# EAGLE schematic final-schematic (EAGLE 8.4.1)
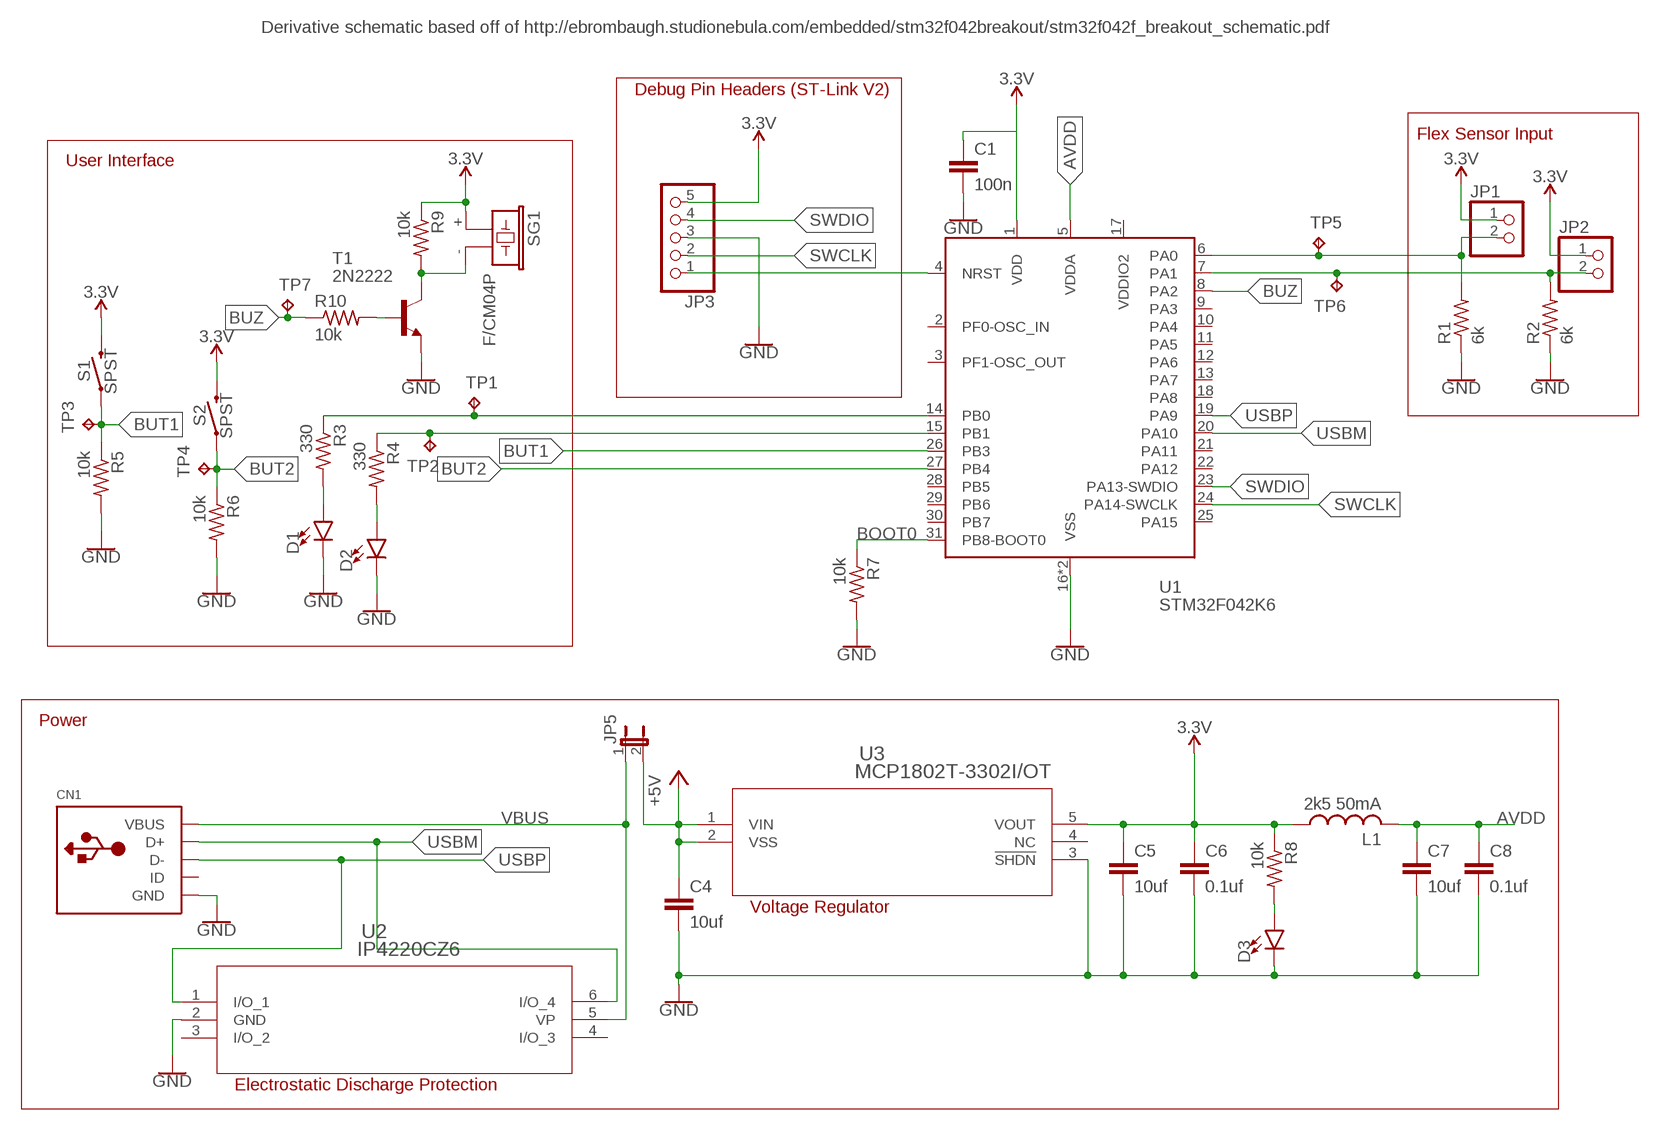
[diagram p0: schematic, sheet 1]

## Parts
C1  100n  C-EUC0805  [C0805]
C4  10uf  C-EUC0805  [C0805]
C5  10uf  C-EUC0805  [C0805]
C6  0.1uf  C-EUC0805  [C0805]
C7  10uf  C-EUC0805  [C0805]
C8  0.1uf  C-EUC0805  [C0805]
CN1  USBMOLEX  [USB-MINIB-THM-MOLEX]
D1  LED10MM  [LED_10MM]
D2  LED10MM  [LED_10MM]
D3  LED10MM  [LED_10MM]
JP1  PINHD-1X2  [1X02]
JP2  PINHD-1X2  [1X02]
JP3  PINHD-1X5  [1X05]
JP5  JP1E  [JP1]
L1  2k5 50mA  L-USL3216C  [L3216C]
R1  6k  R-US_R0805  [R0805]
R2  6k  R-US_R0805  [R0805]
R3  330  R-US_R0805  [R0805]
R4  330  R-US_R0805  [R0805]
R5  10k  R-US_R0805  [R0805]
R6  10k  R-US_R0805  [R0805]
R7  10k  R-US_R0805  [R0805]
R8  10k  R-US_R0805  [R0805]
R9  10k  R-US_R0805  [R0805]
R10  10k  R-US_R0805  [R0805]
S1  SPST  MOMENTARY-SWITCH-SPST-PTH-6.0MM  [TACTILE_SWITCH_PTH_6.0MM]
S2  SPST  MOMENTARY-SWITCH-SPST-PTH-6.0MM  [TACTILE_SWITCH_PTH_6.0MM]
SG1  F/CM04P  [F/CM04P]
T1  2N2222  [TO92-EBC-OVAL]
TP1  TPB2,54  [B2,54]
TP2  TPB2,54  [B2,54]
TP3  TPB2,54  [B2,54]
TP4  TPB2,54  [B2,54]
TP5  TPB2,54  [B2,54]
TP6  TPB2,54  [B2,54]
TP7  TPB2,54  [B2,54]
U1  STM32F042K6  [QFP32-7X7]
U2  IP4220CZ6  [SOT457]
U3  MCP1802T-3302I/OT  [SOT-23-5_MC]

## Nets
3.3V: C1.1 C5.1 C6.1 JP1.1 JP2.1 JP3.5 L1.1 R8.1 R9.1 S1.3 S2.3 SG1.+ U1.1(VDD) U3.5(VOUT)
+5V: C4.1 JP5.2 U3.1(VIN) U3.2(VSS)
AVDD: C7.1 C8.1 L1.2 U1.5(VDDA)
BOOT0: R7.1 U1.31(PB8-BOOT0)
BUT1: R5.1 S1.1 TP3.TP U1.26(PB3)
BUT2: R6.1 S2.1 TP4.TP U1.27(PB4)
BUZ: R10.1 TP7.TP U1.8(PA2)
GND: C4.2 C5.2 C6.2 C7.2 C8.2 CN1.GND D1.C D2.C D3.C JP3.3 R1.1 R2.1 R5.2 R6.2 R7.2 T1.E U1.16(VSS) U1.32(VSS) U2.2(GND) U3.3(!SHDN)
N$1: JP1.2 R1.2 TP5.TP U1.6(PA0)
N$2: JP2.2 R2.2 TP6.TP U1.7(PA1)
N$3: R3.1 TP1.TP U1.14(PB0)
N$4: R4.1 TP2.TP U1.15(PB1)
N$5: D1.A R3.2
N$6: D2.A R4.2
N$7: R9.2 SG1.- T1.C
N$8: R10.2 T1.B
N$9: D3.A R8.2
N$11: C1.2 ; supply symbol labelled GND
NRST: JP3.1 U1.4(NRST)
SWCLK: JP3.2 U1.24(PA14-SWCLK)
SWDIO: JP3.4 U1.23(PA13-SWDIO)
USBM: CN1.D+ U1.20(PA10) U2.6(I/O_4)
USBP: CN1.D- U1.19(PA9) U2.1(I/O_1)
VBUS: CN1.VBUS JP5.1 U2.5(VP)
Unconnected: CN1.ID U1.2(PF0-OSC_IN) U1.3(PF1-OSC_OUT) U1.9(PA3) U1.10(PA4) U1.11(PA5) U1.12(PA6) U1.13(PA7) U1.18(PA8) U1.21(PA11) U1.22(PA12) U1.25(PA15) U1.28(PB5) U1.29(PB6) U1.30(PB7) U2.3(I/O_2) U2.4(I/O_3) U3.4(NC)

## Notes on the sheet
- Derivative schematic based off of http://ebrombaugh.studionebula.com/embedded/stm32f042breakout/stm32f042f_breakout_schematic.pdf
- Debug Pin Headers (ST-Link V2)
- Flex Sensor Input
- User Interface
- Power
- Voltage Regulator
- Electrostatic Discharge Protection

## Power pins joined to a net without a drawn wire
VDDIO2: U1.17(VDDIO2)

## Library data of the parts
C1 C4-C8 = rcl:C-EU: CAPACITOR, European symbol
CN1 = adafruit:USB: USB Connectors USBMINIB - Surface Mount Female Mini-B USB Connector 4UConnector: 06564 By microbuilder.eu Thru-hole RA Female Mini-B USB Connector 4UConnector: 18732 By ladyada.net
D1-D3 = SparkFun-LED:LED: LED (Generic) Standard schematic elements and footprints for 5mm, 3mm, 1206, and 0603 sized LEDs. Generic LEDs with no color specified.
JP1 JP2 = pinhead:PINHD-1X2: PIN HEADER
JP3 = pinhead:PINHD-1X5: PIN HEADER
JP5 = jumper:JP1E: JUMPER
L1 = rcl:L-US: INDUCTOR, American symbol
R1-R10 = rcl:R-US_: RESISTOR, American symbol
S1 S2 = SparkFun-Switches:MOMENTARY-SWITCH-SPST: Momentary Switch (Pushbutton) - SPST Normally-open (NO) SPST momentary switches (buttons, pushbuttons). Variants PTH-12MM - 12mm square, through-hole Momentary Pushbutton Switch - 12mm Square <https://www.sparkfun.com/products/9190> (COM-09190) PTH-6.0MM, PTH-6.0MM-KIT - 6.0mm square, through-hole Mini Pushbutton Switch <https://www.sparkfun.com/products/97> (COM-00097) KIT package intended for soldering kit's - only one side of pads' copper is exposed. PTH-RIGHT-ANGLE-KIT - Right-angle, through-hole Right Angle Tactile Button <https://www.sparkfun.com/products/10791> - Used on SparkFun BigTime Watch Kit <https://www.sparkfun.com/products/11734> SMD-12MM - 12mm square, surface-mount Tactile Button - SMD (12mm) <https://www.sparkfun.com/products/12993> (COM-12993) Used on SparkFun PicoBoard <https://www.sparkfun.com/products/11888> SMD-4.5MM - 4.5mm Square Trackball Switch Used on SparkFun Blackberry Trackballer Breakout <https://www.sparkfun.com/products/13169> SMD-4.6MMX2.8MM - 4.60mm x 2.80mm, surface mount Used on SparkFun SAMD21 Mini Breakout <https://www.sparkfun.com/products/13664> SMD-5.2MM, SMD-5.2-REDUNDANT - 5.2mm square, surface-mount Mini Pushbutton Switch - SMD <https://www.sparkfun.com/products/8720> (COM-08720) Used on Arduino Pro Mini <https://www.sparkfun.com/products/11114> REDUNDANT package connects both switch circuits together SMD-6.0X3.5MM - 6.0 x 3.5mm, surface mount Momentary Reset Switch SMD <https://www.sparkfun.com/products/8229> (COM-08229) SMD-6.2MM-TALL - 6.2mm square, surface mount Tactile Button - SMD (6mm) <https://www.sparkfun.com/products/12992> Used on SparkFun Digital Sandbox <https://www.sparkfun.com/products/12651> SMD-RIGHT-ANGLE - Right-angle, surface mount Used on SparkFun Block for Intel® Edison - Arduino <https://www.sparkfun.com/products/13036>; PROD_ID: SWCH-08441; SF_SKU: COM-00097
SG1 = buzzer:F/CM04P: BUZZER Source: Buerklin; OC_FARNELL: unknown; OC_NEWARK: unknown
T1 = adafruit:2N2222: NPN TRANSISTOR Big oval pads
TP1-TP7 = testpad:TP: Test pad
U1 = STM32F042K:STM32F042K6
U2 = IP4220CZ6:IP4220CZ6; MANUFACTURER_PART_NUMBER: IP4220CZ6; VENDOR: NXP
U3 = MCP1802T:MCP1802T-3302I/OT; MANUFACTURER_PART_NUMBER: MCP1802T3302IOT; VENDOR: Microchip